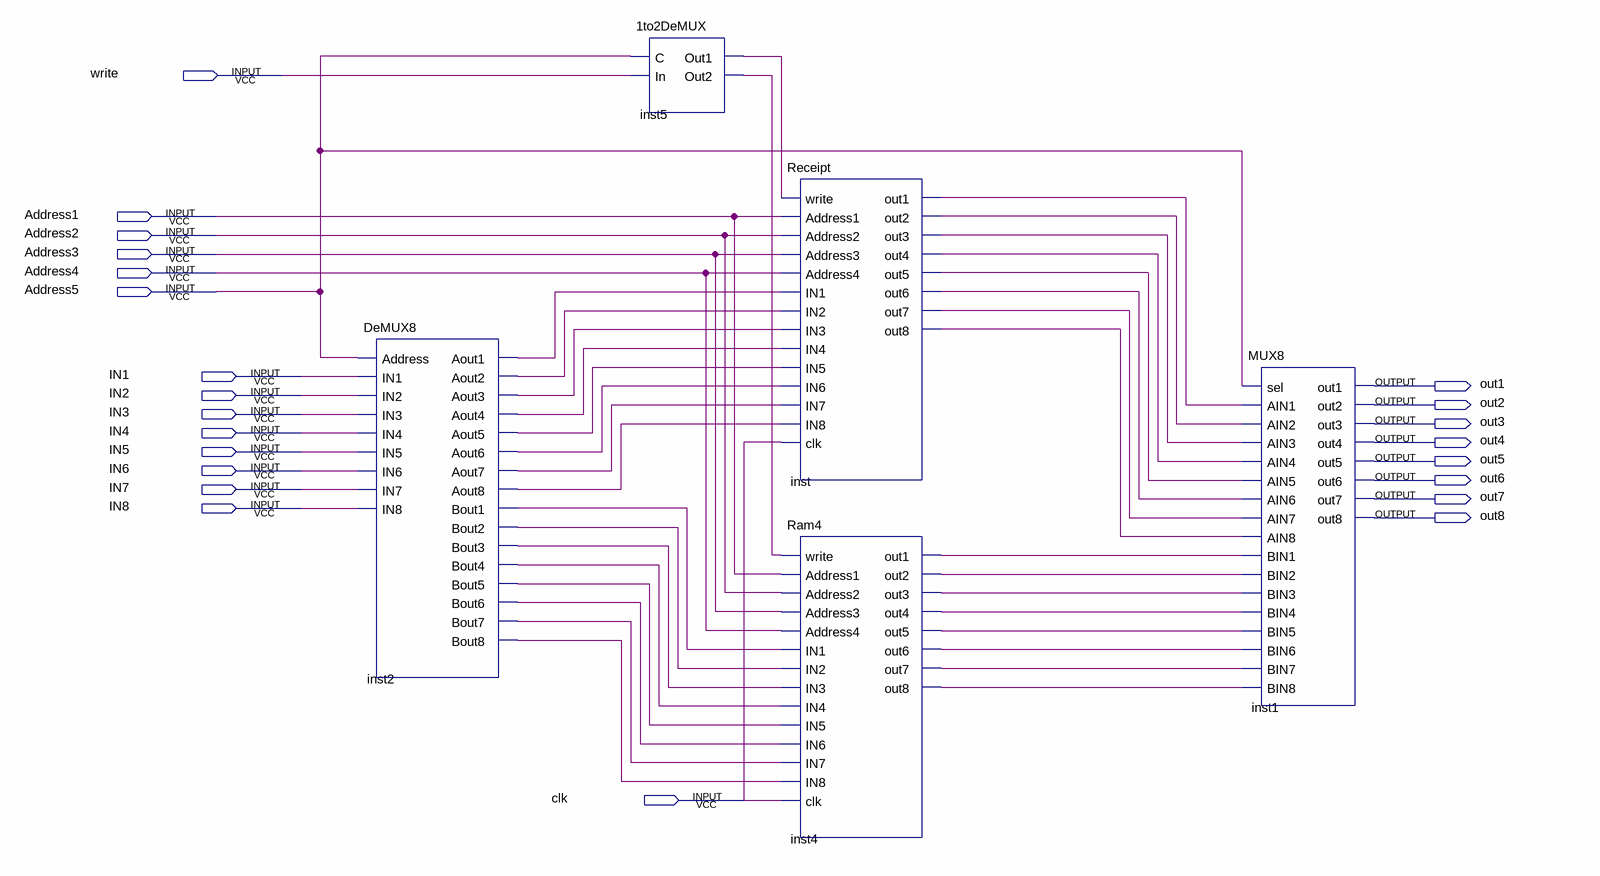
[diagram p0: schematic sheet]
// Quartus schematic Ram5.bdf as structural Verilog: 5 symbols, 23 pins
module Ram5 (
  input  write,
  input  Address1,
  input  Address2,
  input  Address3,
  input  Address4,
  input  Address5,
  input  IN1,
  input  IN2,
  input  IN3,
  input  IN4,
  input  IN5,
  input  IN6,
  input  IN7,
  input  IN8,
  input  clk,
  output out1,
  output out2,
  output out3,
  output out4,
  output out5,
  output out6,
  output out7,
  output out8
);

  wire inst2_aout1, inst2_aout2, inst2_aout3, inst2_aout4, inst2_aout5, inst2_aout6, inst2_aout7,
       inst2_aout8, inst2_bout1, inst2_bout2, inst2_bout3, inst2_bout4, inst2_bout5, inst2_bout6,
       inst2_bout7, inst2_bout8, inst4_out1, inst4_out2, inst4_out3, inst4_out4, inst4_out5, inst4_out6,
       inst4_out7, inst4_out8, inst5_out1, inst5_out2, inst_out1, inst_out2, inst_out3, inst_out4, inst_out5,
       inst_out6, inst_out7, inst_out8;

  DeMUX8 inst2 (
    .Address(Address5), .IN1(IN1), .IN2(IN2), .IN3(IN3), .IN4(IN4), .IN5(IN5), .IN6(IN6), .IN7(IN7),
    .IN8(IN8), .Aout1(inst2_aout1), .Aout2(inst2_aout2), .Aout3(inst2_aout3), .Aout4(inst2_aout4),
    .Aout5(inst2_aout5), .Aout6(inst2_aout6), .Aout7(inst2_aout7), .Aout8(inst2_aout8), .Bout1(inst2_bout1),
    .Bout2(inst2_bout2), .Bout3(inst2_bout3), .Bout4(inst2_bout4), .Bout5(inst2_bout5), .Bout6(inst2_bout6),
    .Bout7(inst2_bout7), .Bout8(inst2_bout8));
  \1to2DeMUX  inst5 (.C(Address5), .In(write), .Out1(inst5_out1), .Out2(inst5_out2));
  Receipt inst (
    .write(inst5_out1), .Address1(Address1), .Address2(Address2), .Address3(Address3), .Address4(Address4),
    .IN1(inst2_aout1), .IN2(inst2_aout2), .IN3(inst2_aout3), .IN4(inst2_aout4), .IN5(inst2_aout5),
    .IN6(inst2_aout6), .IN7(inst2_aout7), .IN8(inst2_aout8), .clk(clk), .out1(inst_out1), .out2(inst_out2),
    .out3(inst_out3), .out4(inst_out4), .out5(inst_out5), .out6(inst_out6), .out7(inst_out7), .out8(inst_out8));
  Ram4 inst4 (
    .write(inst5_out2), .Address1(Address1), .Address2(Address2), .Address3(Address3), .Address4(Address4),
    .IN1(inst2_bout1), .IN2(inst2_bout2), .IN3(inst2_bout3), .IN4(inst2_bout4), .IN5(inst2_bout5),
    .IN6(inst2_bout6), .IN7(inst2_bout7), .IN8(inst2_bout8), .clk(clk), .out1(inst4_out1), .out2(inst4_out2),
    .out3(inst4_out3), .out4(inst4_out4), .out5(inst4_out5), .out6(inst4_out6), .out7(inst4_out7),
    .out8(inst4_out8));
  MUX8 inst1 (
    .sel(Address5), .AIN1(inst_out1), .AIN2(inst_out2), .AIN3(inst_out3), .AIN4(inst_out4), .AIN5(inst_out5),
    .AIN6(inst_out6), .AIN7(inst_out7), .AIN8(inst_out8), .BIN1(inst4_out1), .BIN2(inst4_out2),
    .BIN3(inst4_out3), .BIN4(inst4_out4), .BIN5(inst4_out5), .BIN6(inst4_out6), .BIN7(inst4_out7),
    .BIN8(inst4_out8), .out1(out1), .out2(out2), .out3(out3), .out4(out4), .out5(out5), .out6(out6),
    .out7(out7), .out8(out8));
endmodule
